# Altium project MB1364.PrjPcb
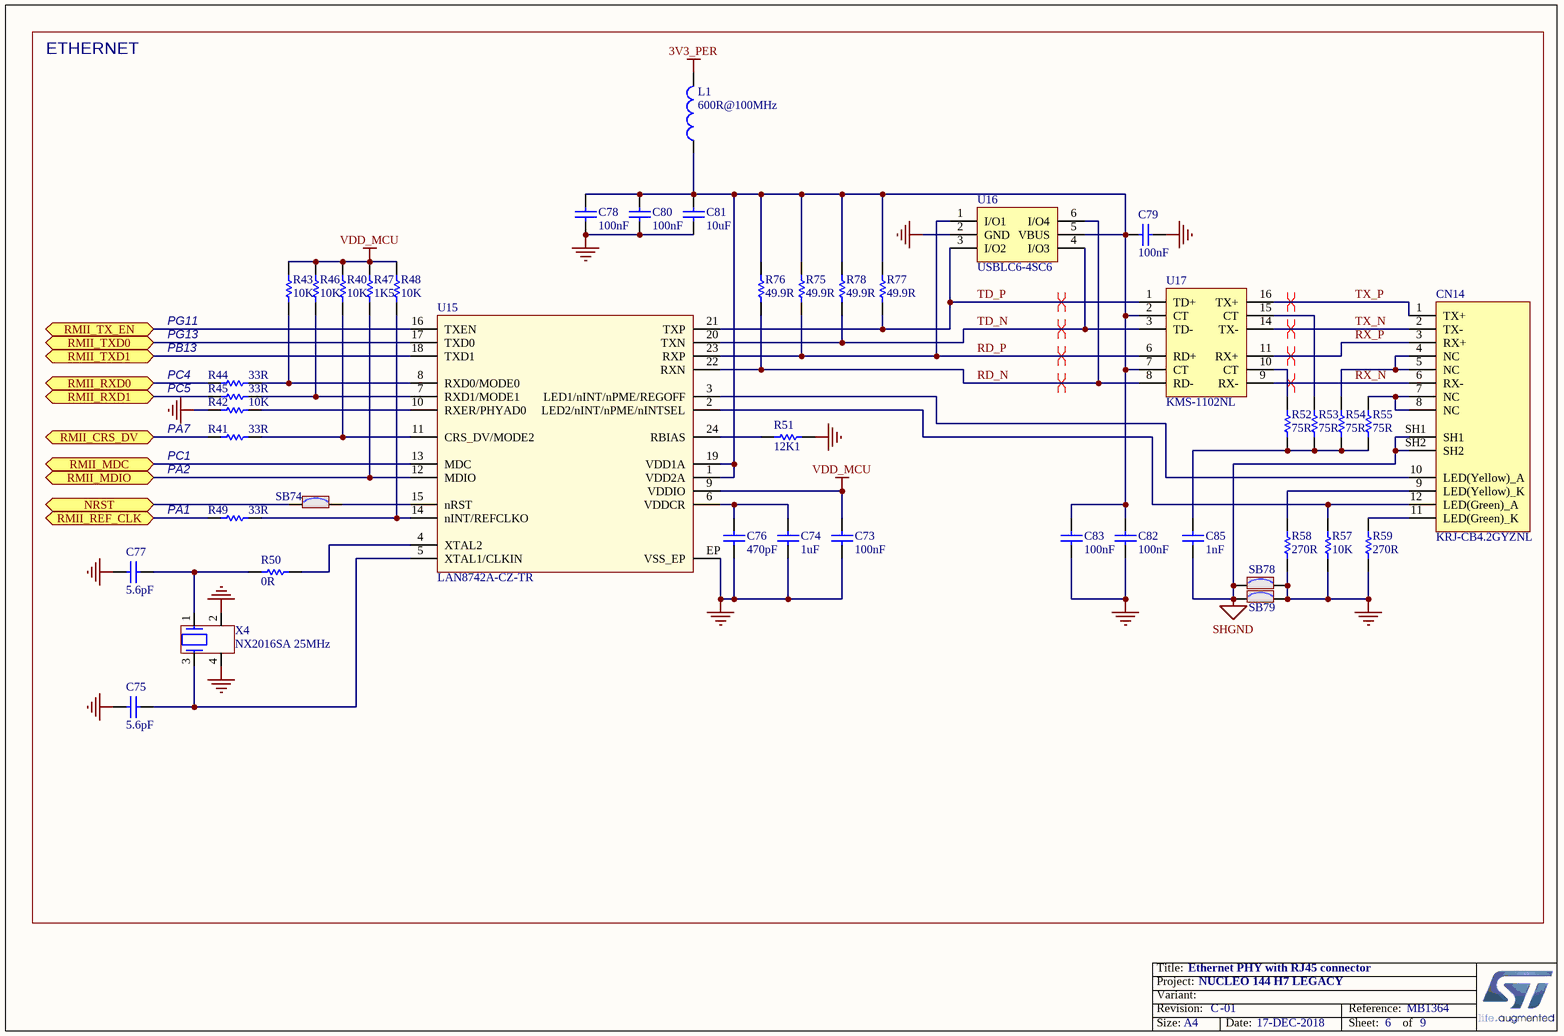
[diagram p0: Ethernet.SchDoc]
Board_Assembly_Revision: 01; Board_Document_Date: 17-DEC-2018; Board_Name: NUCLEO 144 H7 LEGACY; Board_PCB_Revision: C; Board_Reference: MB1364
2 sheets, 59 parts. Net scope: flat (ports and power ports of the same name join across sheets).
Board file: MB1364.PcbDoc
Sheets:
  Ethernet.SchDoc
  USB.SchDoc

## Sheet Ethernet.SchDoc: Ethernet PHY with RJ45 connector
size A4; Date: Not used; ApprovedBy: Not used; CheckedBy: Not used; Author: Not used; CompanyName: STMicroelectronics; DrawnBy: Not used; Engineer: Not used; Organization: Not used; Address1: Not used; Address2: Not used; Address3: Not used; Address4: Not used; DocumentNumber: 6; Revision: Not used; SheetNumber: 6; SheetTotal: 9; Time: Not used; ImagePath: Not used; Application_BuildNumber: Not used

### Parts
C73  value 100nF  [C0603]  (hidden comment: Capacitor)
C74  value 1uF  [C0402]  (hidden comment: Capacitor)
C75  value 5.6pF  [C0402]  (hidden comment: Capacitor)
C76  value 470pF  [C0402]  (hidden comment: Capacitor)
C77  value 5.6pF  [C0402]  (hidden comment: Capacitor)
C78  value 100nF  [C0603]  (hidden comment: Capacitor)
C79  value 100nF  [C0603]  (hidden comment: Capacitor)
C80  value 100nF  [C0603]  (hidden comment: Capacitor)
C81  value 10uF  [C0603]  (hidden comment: Capacitor)
C82  value 100nF  [C0603]  (hidden comment: Capacitor)
C83  value 100nF  [C0603]  (hidden comment: Capacitor)
C85  value 1nF  [C1206_H1P6]  (hidden comment: Capacitor)
CN14  value KRJ-CB4.2GYZNL  [CON_RJ45_DGKYD_KRJ-CB4.2GYZNL]  (hidden comment: RJ45_KRJ-CB4.2GYZNL)
L1  value 600R@100MHz  [L0603]  (hidden comment: BEAD)
R40  value 10K  [R0402]  (hidden comment: Resistor)
R41  value 33R  [R0402]  (hidden comment: Resistor)
R42  value 10K  [R0402]  (hidden comment: Resistor)
R43  value 10K  [R0402]  (hidden comment: Resistor)
R44  value 33R  [R0402]  (hidden comment: Resistor)
R45  value 33R  [R0402]  (hidden comment: Resistor)
R46  value 10K  [R0402]  (hidden comment: Resistor)
R47  value 1K5  [R0402]  (hidden comment: Resistor)
R48  value 10K  [R0402]  (hidden comment: Resistor)
R49  value 33R  [R0402]  (hidden comment: Resistor)
R50  value 0R  [R0402]  (hidden comment: Resistor)
R51  value 12K1  [R0402]  (hidden comment: Resistor)
R52  value 75R  [R0402]  (hidden comment: Resistor)
R53  value 75R  [R0402]  (hidden comment: Resistor)
R54  value 75R  [R0402]  (hidden comment: Resistor)
R55  value 75R  [R0402]  (hidden comment: Resistor)
R57  value 10K  [R0402]  (hidden comment: Resistor)
R58  value 270R  [R0402]  (hidden comment: Resistor)
R59  value 270R  [R0402]  (hidden comment: Resistor)
R75  value 49.9R  [R0402]  (hidden comment: Resistor)
R76  value 49.9R  [R0402]  (hidden comment: Resistor)
R77  value 49.9R  [R0402]  (hidden comment: Resistor)
R78  value 49.9R  [R0402]  (hidden comment: Resistor)
SB74  SB_ON  [SOLDER-BRIDGE_R0603-0R]  (value not drawn)
SB78  SB_ON  [SOLDER-BRIDGE_R0603-0R]  (value not drawn)
SB79  SB_ON  [SOLDER-BRIDGE_R0603-0R]  (value not drawn)
U15  LAN8742A-CZ-TR  [ICC_VQFN24-EPAD_4X4_P050]
U16  USBLC6-4SC6  [ESD_SOT23-6L]
U17  KMS-1102NL  [TRS_DGKYD_KMS-1102NL]
X4  value NX2016SA 25MHz  [CRY_NX2016SA_4P]  (hidden comment: XTAL_4_PINS)

### Ports
NRST (bidir), RMII_CRS_DV (bidir), RMII_MDC (bidir), RMII_MDIO (bidir), RMII_REF_CLK (bidir), RMII_RXD0 (bidir), RMII_RXD1 (bidir), RMII_TX_EN (bidir), RMII_TXD0 (bidir), RMII_TXD1 (bidir)

### Nets
3V3_PER: L1.2
GND: C73.1 C74.1 C75.1 C76.1 C77.1 C78.1 C79.2 C80.1 C81.1 C82.1 C83.1 R42.2 R51.2 R57.1 R58.1 R59.1 SB78.2 SB79.2 U15.EP(VSS_EP) U16.2(GND) X4.2 X4.4
SHGND: C85.1 CN14.SH1 CN14.SH2 SB78.1 SB79.1
VDD_MCU: C73.2 R40.2 R43.2 R46.2 R47.2 R48.2 U15.9(VDDIO)
NRST: SB74.1 ; port NRST
RD_N: R76.1 U15.22(RXN) U16.6(I/O4) U17.8(RD-)
RD_P: R75.1 U15.23(RXP) U16.1(I/O1) U17.6(RD+)
RMII_CRS_DV: R41.1 ; port RMII_CRS_DV
RMII_MDC: U15.13(MDC) ; port RMII_MDC
RMII_MDIO: R47.1 U15.12(MDIO) ; port RMII_MDIO
RMII_REF_CLK: R49.1 ; port RMII_REF_CLK
RMII_RXD0: R44.1 ; port RMII_RXD0
RMII_RXD1: R45.1 ; port RMII_RXD1
RMII_TX_EN: U15.16(TXEN) ; port RMII_TX_EN
RMII_TXD0: U15.17(TXD0) ; port RMII_TXD0
RMII_TXD1: U15.18(TXD1) ; port RMII_TXD1
RX_N: CN14.6(RX-) U17.9(RX-)
RX_P: CN14.3(RX+) U17.11(RX+)
TD_N: R78.1 U15.20(TXN) U16.4(I/O3) U17.3(TD-)
TD_P: R77.1 U15.21(TXP) U16.3(I/O2) U17.1(TD+)
TX_N: CN14.2(TX-) U17.14(TX-)
TX_P: CN14.1(TX+) U17.16(TX+)
NetC74_2: C74.2 C76.2 U15.6(VDDCR)
NetC75_2: C75.2 U15.5(XTAL1/CLKIN) X4.3
NetC77_2: C77.2 R50.1 X4.1
NetC78_2: C78.2 C79.1 C80.2 C81.2 C82.2 C83.2 L1.1 R75.2 R76.2 R77.2 R78.2 U15.1(VDD2A) U15.19(VDD1A) U16.5(VBUS) U17.2(CT) U17.7(CT)
NetC85_2: C85.2 R52.1 R53.1 R54.1 R55.1
NetCN14_4: CN14.4(NC) CN14.5(NC) R54.2
NetCN14_7: CN14.7(NC) CN14.8(NC) R55.2
NetCN14_9: CN14.9(LED(Yellow)_K) R58.2
NetCN14_10: CN14.10(LED(Yellow)_A) U15.3(LED1/nINT/nPME/REGOFF)
NetCN14_11: CN14.11(LED(Green)_K) R59.2
NetCN14_12: CN14.12(LED(Green)_A) R57.2 U15.2(LED2/nINT/nPME/nINTSEL)
NetR40_1: R40.1 R41.2 U15.11(CRS_DV/MODE2)
NetR42_1: R42.1 U15.10(RXER/PHYAD0)
NetR43_1: R43.1 R44.2 U15.8(RXD0/MODE0)
NetR45_2: R45.2 R46.1 U15.7(RXD1/MODE1)
NetR48_1: R48.1 R49.2 U15.14(nINT/REFCLKO)
NetR50_2: R50.2 U15.4(XTAL2)
NetR51_1: R51.1 U15.24(RBIAS)
NetR52_2: R52.2 U17.10(CT)
NetR53_2: R53.2 U17.15(CT)
NetSB74_2: SB74.2 U15.15(nRST)

### Layout directives
differential pair: RD_N, RD_P, RX_N, RX_P, TD_N, TD_P, TX_N, TX_P

### Notes on the sheet
- ETHERNET
- PG11
- PG13
- PB13
- PC4
- PC5
- PA7
- PC1
- PA2
- (near R49) PA1
- Title:
- Project:
- Size:
- Revision:
- Variant:
- A4
- -
- Date:
- Reference:
- Sheet:
- of

### Library data of the parts
C73 C78-C80 C82 C83 = MCD-00237: Capacitor, MLCC, 100nF, 6V3, X5R, 10%, 0603, T=0,8mm; Manufacturer_Part_Number: CC0603KRX5R5BB104; Manufacturer: YAGEO; Provided_By: SUBCO; ECCN_US: EAR99; ECCN_EU: NEC; Internal_Part_Number: MCD-00237; Status: Released; Part_Type: Capacitor; Package: C0603; ComponentLink1Description: Datasheet; ComponentLink1URL: http://tunmcdsvn.tun.st.com/Component_Datasheet_Library/Trunk/Capacitors/Yageo_Multilayer_capacitor_X5R_series_100pF_to_100uF
C74 = MCD-00095: Capacitor, MLCC, 1uF, 6V3, X5R, 10%, 0402, T=0,5mm; Manufacturer_Part_Number: GRM155R61E105KA12; Manufacturer: MURATA; Alternate_Manufacturer_Part_Number: GRM155R60J105KE19; Provided_By: SUBCO; ECCN_US: EAR99; ECCN_EU: NEC; Internal_Part_Number: MCD-00095; Status: Released; Part_Type: Capacitor; Package: C0402; ComponentLink1Description: Datasheet; ComponentLink1URL: http://tunmcdsvn.tun.st.com/Component_Datasheet_Library/Trunk/Capacitors/Murata_Capacitor_GR_series; Alternate_Manufacturer: MURATA
C75 C77 = MCD-01374: Capacitor, MLCC, 5.6pF, 50V, NPO, 5%, 0402, T=0,5mm; Manufacturer_Part_Number: CC0402BRNPO9BN5R6; Manufacturer: YAGEO; Provided_By: SUBCO; Internal_Part_Number: MCD-01374; Status: Released; Part_Type: Capacitor; Package: C0402; ComponentLink1Description: Datasheet; ComponentLink1URL: http://tunmcdsvn.tun.st.com/Component_Datasheet_Library/Trunk/Capacitors/Yageo_Capacitor_NP0_16V-to-50V; ECCN_US: N/A; ECCN_EU: N/A
C76 = MCD-00724: Capacitor, MLCC, 470pF, 50V, NPO, 5%, 0402, T=0,5mm; Manufacturer_Part_Number: CC0402JRNPO9BN471; Manufacturer: YAGEO; Provided_By: SUBCO; Internal_Part_Number: MCD-00724; Status: Released; Part_Type: Capacitor; Package: C0402; ComponentLink1Description: Datasheet; ComponentLink1URL: http://tunmcdsvn.tun.st.com/Component_Datasheet_Library/Trunk/Capacitors/Yageo_Capacitor_NP0_16V-to-50V; ECCN_US: N/A; ECCN_EU: N/A
C81 = MCD-01124: Capacitor, MLCC, 10µF, 10V, X5R, 10%, 0603, T=0.8mm; Manufacturer_Part_Number: GRM188R61A106KAAL; Manufacturer: MURATA; Provided_By: SUBCO; ECCN_US: EAR99; ECCN_EU: NEC; Internal_Part_Number: MCD-01124; Status: Released; Part_Type: Capacitor; Package: C0603; ComponentLink1Description: Datasheet; ComponentLink1URL: http://tunmcdsvn.tun.st.com/Component_Datasheet_Library/Trunk/Capacitors/Murata_Capacitor_GR_series
C85 = MCD-00722: Capacitor, MLCC, 1nF, 2KV, X7R, 10%, 1206, T=1,25mm; Manufacturer_Part_Number: CC1206KKX7RDBB102; Manufacturer: YAGEO; Provided_By: SUBCO; Internal_Part_Number: MCD-00722; Status: Released; Part_Type: Capacitor; Package: C1206; ComponentLink1Description: Datasheet; ComponentLink1URL: http://tunmcdsvn.tun.st.com/Component_Datasheet_Library/Trunk/Capacitors/Yageo_Multilayer_Capacitor_NPO_X7R_1KV_to_3KV_10pF_to_33nF/; ECCN_US: N/A; ECCN_EU: N/A
CN14 = MCD-00717: RJ45 jack, single port, with LEDS, Metal shielded dip low profile; Part_Type: Connector; Manufacturer: DONGGUAN KEYOUDA ELECTRONIC TECHNOLOGY; Provided_By: SUBCO; Internal_Part_Number: MCD-00717; Status: Released; Manufacturer_Part_Number: KRJ-CB4.2GYZNL; ComponentLink1Description: Datasheet; ComponentLink1URL: http://tunmcdsvn.tun.st.com/Component_Datasheet_Library/Trunk/Connectors/DGKYD_RJ45_KRJ-CB4.2GYZNL; ECCN_US: n/a; ECCN_EU: n/a
L1 = MCD-00047: SMD Chip ferrite bead, 600R@100MHz +/-25%, 350mA, 500mohm DC, 0603, T=0.8mm; Part_Type: Inductor; Manufacturer_Part_Number: FCM1608KF-601T03; Manufacturer: TAI-TECH; Provided_By: SUBCO; Internal_Part_Number: MCD-00047; Status: Released; ComponentLink1Description: Datasheet; ComponentLink1URL: http://tunmcdsvn.tun.st.com/Component_Datasheet_Library/Trunk/Inductors/TaiTech_Bead_FCM1608_series; ECCN_US: n/a; ECCN_EU: n/a
R40 R42 R43 R46 R48 R57 = MCD-00053: Resistor,10K,0402,1%,1/16W; Manufacturer_Part_Number: RC0402FR-0710KL; Manufacturer: YAGEO; Provided_By: SUBCO; ECCN_US: EAR99; ECCN_EU: NEC; Internal_Part_Number: MCD-00053; Status: Released; Part_Type: Resistor; Package: R0402; ComponentLink1Description: Datasheet; ComponentLink1URL: http://tunmcdsvn.tun.st.com/Component_Datasheet_Library/Trunk/Resistors/Yageo_Resistor_RC0402-series
R41 R44 R45 R49 = MCD-00455: Resistor,33R,0402,1%,1/16W; Manufacturer_Part_Number: RC0402FR-0733RL; Manufacturer: YAGEO; Provided_By: SUBCO; ECCN_US: EAR99; ECCN_EU: NEC; Internal_Part_Number: MCD-00455; Status: Released; Part_Type: Resistor; Package: R0402; ComponentLink1Description: Datasheet; ComponentLink1URL: http://tunmcdsvn.tun.st.com/Component_Datasheet_Library/Trunk/Resistors/Yageo_Resistor_RC0402-series
R47 = MCD-00068: Resistor,1K5,0402,1%,1/16W; Manufacturer_Part_Number: RC0402FR-071K5L; Manufacturer: YAGEO; Provided_By: SUBCO; ECCN_US: EAR99; ECCN_EU: NEC; Internal_Part_Number: MCD-00068; Status: Released; Part_Type: Resistor; Package: R0402; ComponentLink1Description: Datasheet; ComponentLink1URL: http://tunmcdsvn.tun.st.com/Component_Datasheet_Library/Trunk/Resistors/Yageo_Resistor_RC0402-series
R50 = MCD-00052: Resistor,0R,0402,5%,1/16W; Manufacturer_Part_Number: RC0402JR-070RL; Manufacturer: YAGEO; Provided_By: SUBCO; ECCN_US: EAR99; ECCN_EU: NEC; Internal_Part_Number: MCD-00052; Status: Released; Part_Type: Resistor; Package: R0402; ComponentLink1Description: Datasheet; ComponentLink1URL: http://tunmcdsvn.tun.st.com/Component_Datasheet_Library/Trunk/Resistors/Yageo_Resistor_RC0402-series
R51 = MCD-00723: Resistor,12K1,0402,1%,1/16W; Manufacturer_Part_Number: RC0402FR-0712K1L; Manufacturer: YAGEO; Provided_By: SUBCO; ECCN_US: EAR99; ECCN_EU: NEC; Internal_Part_Number: MCD-00723; Status: Released; Part_Type: Resistor; Package: R0402; ComponentLink1Description: Datasheet; ComponentLink1URL: http://tunmcdsvn.tun.st.com/Component_Datasheet_Library/Trunk/Resistors/Yageo_Resistor_RC0402-series
R52-R55 = MCD-00515: Resistor,75R,0402,1%,1/16W; Manufacturer_Part_Number: RC0402FR-0775RL; Manufacturer: YAGEO; Provided_By: SUBCO; ECCN_US: EAR99; ECCN_EU: NEC; Internal_Part_Number: MCD-00515; Status: Released; Part_Type: Resistor; Package: R0402; ComponentLink1Description: Datasheet; ComponentLink1URL: http://tunmcdsvn.tun.st.com/Component_Datasheet_Library/Trunk/Resistors/Yageo_Resistor_RC0402-series
R58 R59 = MCD-00441: Resistor,270R,0402,1%,1/16W; Manufacturer_Part_Number: RC0402FR-07270RL; Manufacturer: YAGEO; Provided_By: SUBCO; ECCN_US: EAR99; ECCN_EU: NEC; Internal_Part_Number: MCD-00441; Status: Released; Part_Type: Resistor; Package: R0402; ComponentLink1Description: Datasheet; ComponentLink1URL: http://tunmcdsvn.tun.st.com/Component_Datasheet_Library/Trunk/Resistors/Yageo_Resistor_RC0402-series
R75-R78 = MCD-00565: Resistor,49R9,0402,1%,1/16W; Manufacturer_Part_Number: RC0402FR-0749R9L; Manufacturer: YAGEO; Provided_By: SUBCO; ECCN_US: EAR99; ECCN_EU: NEC; Internal_Part_Number: MCD-00565; Status: Released; Part_Type: Resistor; Package: R0402; ComponentLink1Description: Datasheet; ComponentLink1URL: http://tunmcdsvn.tun.st.com/Component_Datasheet_Library/Trunk/Resistors/Yageo_Resistor_RC0402-series
SB74 SB78 SB79 = MCD-00071: Solder Bridge ON; Part_Type: Mechanical; Manufacturer_Part_Number: RC0603JR-070RL; Manufacturer: YAGEO; Provided_By: SUBCO; Internal_Part_Number: MCD-00071; Status: Released; ComponentLink1Description: Datasheet; Package: SB0603; ComponentLink1URL: http://tunmcdsvn.tun.st.com/Component_Datasheet_Library/Trunk/Resistors/Yageo_Resistor_RC0603-series; ECCN_US: n/a; ECCN_EU: n/a
U15 = MCD-00719: 10/100M RMII Ethernet transceiver; Part_Type: IC; Manufacturer: MICROCHIP; Provided_By: SUBCO; Internal_Part_Number: MCD-00719; Value: LAN8742A-CZ-TR; Status: Released; Manufacturer_Part_Number: LAN8742A-CZ-TR; ComponentLink1Description: Datasheet; ComponentLink1URL: http://tunmcdsvn.tun.st.com/Component_Datasheet_Library/Trunk/IC/MICROCHIP_LAN8742A_RMII_PHY; ECCN_US: n/a; ECCN_EU: n/a
U16 = MCD-00250: Very low capacitance ESD protection , 4 lines; Part_Type: IC; Manufacturer: STMICROELECTRONICS; BMS_Part_Number: 9151001; Provided_By: SUBCO with ST control; ECCN_US: EAR99; ECCN_EU: NEC; Internal_Part_Number: MCD-00250; Value: USBLC6-4SC6; Status: Released; Manufacturer_Part_Number: USBLC6-4SC6; ComponentLink1Description: Datasheet; ComponentLink1URL: http://tunmcdsvn.tun.st.com/Component_Datasheet_Library/Trunk/Diodes/STM_ESD_USBLC6-4SC6
U17 = MCD-00718: Discrete Magnetic Transformer Module, 16 pins, SMT, 100 Base-TX; Part_Type: IC; Manufacturer: DONGGUAN KEYOUDA ELECTRONIC TECHNOLOGY; Provided_By: SUBCO; Internal_Part_Number: MCD-00718; Value: KMS-1102NL; Status: Released; Manufacturer_Part_Number: KMS-1102NL; ComponentLink1Description: Datasheet; ComponentLink1URL: http://tunmcdsvn.tun.st.com/Component_Datasheet_Library/Trunk/IC/DGKYD_KMS-1102NL; ECCN_US: n/a; ECCN_EU: n/a
X4 = MCD-01364: Crystal 25MHz, 6pF, +-20ppm, 80ohms max, SMD; Part_Type: Crystal_Osc; Manufacturer_Part_Number: NX2016SA 25MHz EXS00A-CS11321; Manufacturer: NDK; BMS_Part_Number: 9157044; Provided_By: SUBCO; ECCN_US: EAR99; ECCN_EU: NEC; Internal_Part_Number: MCD-01364; Status: Released; Package: NX2016SA; ComponentLink1Description: Datasheet; ComponentLink1URL: http://tunmcdsvn.tun.st.com/Component_Datasheet_Library/Trunk/Crystal_Osc/NDK_NX2016SA 25MHz EXS00A-CS11321 (EXS10B-28187); Order_Code_Digikey: 644-1367

## Sheet USB.SchDoc: USB
size A4; Date: Not used; ApprovedBy: Not used; CheckedBy: Not used; Author: Not used; CompanyName: STMicroelectronics; DrawnBy: Not used; Engineer: Not used; Organization: Not used; Address1: Not used; Address2: Not used; Address3: Not used; Address4: Not used; DocumentNumber: 7; Revision: Not used; SheetNumber: 7; SheetTotal: 9; CurrentTime: Not used; CurrentDate: Not used; Time: Not used; DocumentFullPathAndName: Not used; DocumentName: Not used; ModifiedDate: Not used; ImagePath: Not used; ProjectName: Not used; Application_BuildNumber: Not used
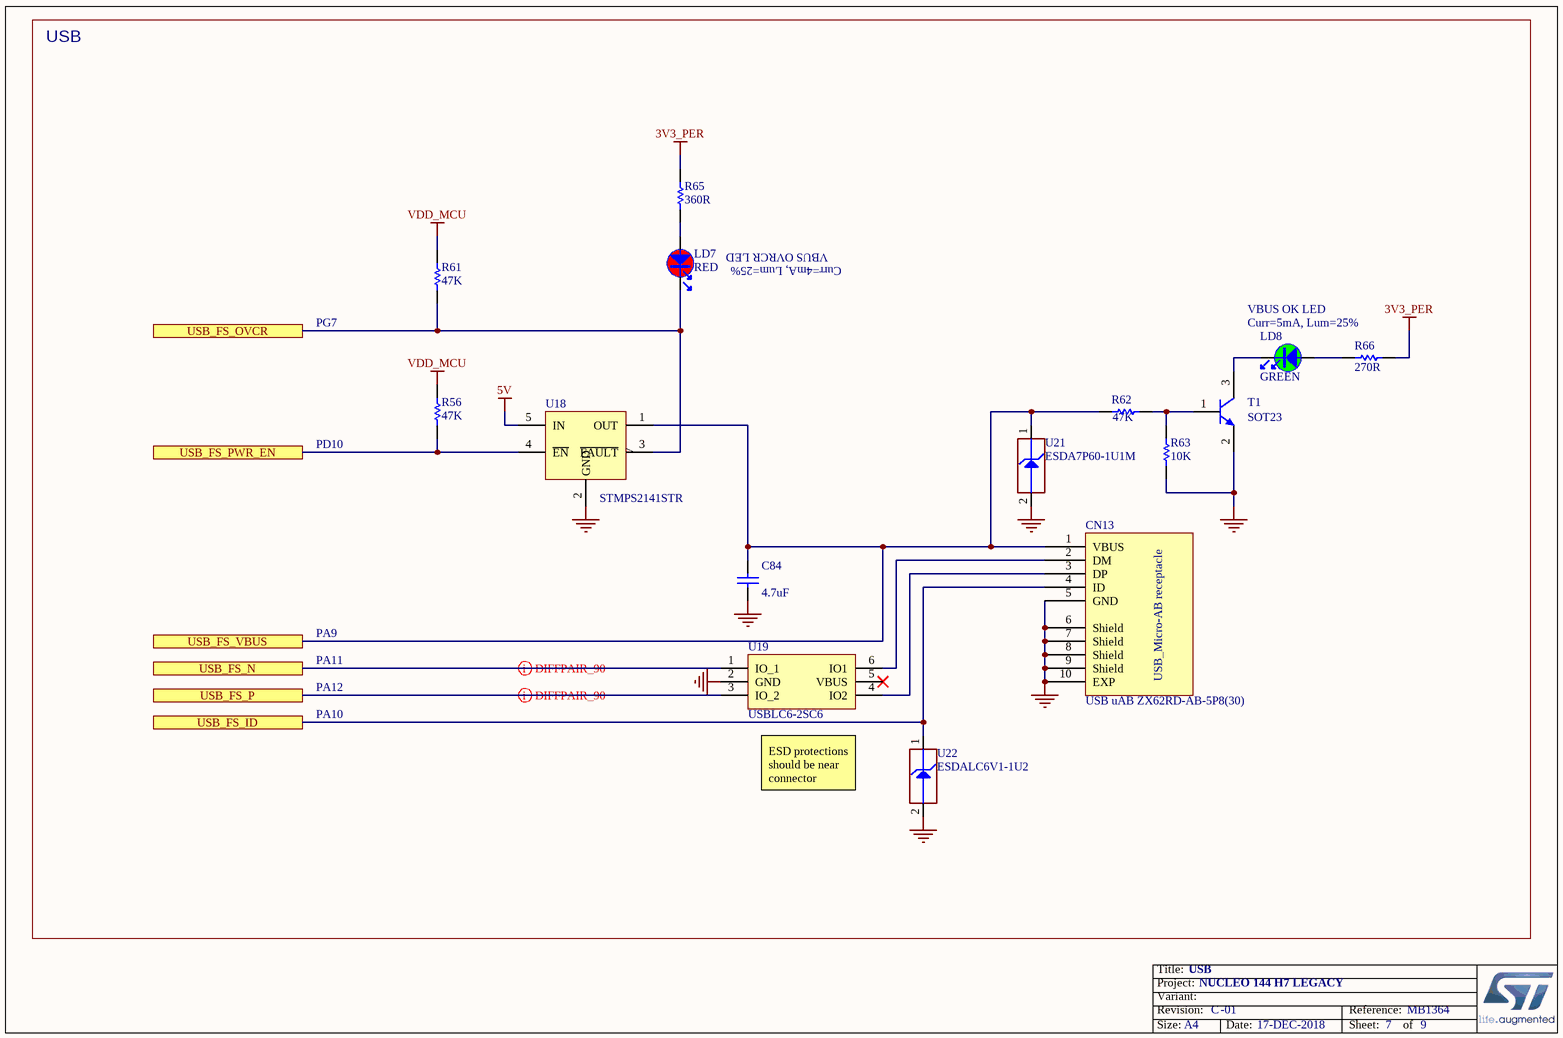
[diagram p1: USB.SchDoc]

### Parts
C84  value 4.7uF  [C0603]  (hidden comment: Capacitor)
CN13  value USB uAB ZX62RD-AB-5P8(30)  [CON_USBMICROAB_MOLEX_47590-0001_H3]  (hidden comment: USB_uAB_47590.0001)
LD7  value RED  [LED_0603_VISHAY_VLMS1300-GS08_RED_1A2K_H0P8]  (hidden comment: LED_red)
LD8  value GREEN  [LED_0603_OSRAM_LG-Q396-PS-35_GREEN_1A2K_H0P4]  (hidden comment: LED_green)
R56  value 47K  [R0402]  (hidden comment: Resistor)
R61  value 47K  [R0402]  (hidden comment: Resistor)
R62  value 47K  [R0402]  (hidden comment: Resistor)
R63  value 10K  [R0402]  (hidden comment: Resistor)
R65  value 360R  [R0402]  (hidden comment: Resistor)
R66  value 270R  [R0402]  (hidden comment: Resistor)
T1  value SOT23  [NPN_SOT23]  (hidden comment: 9013-SOT23)
U18  STMPS2141STR  [MOS_SOT23-5L]
U19  USBLC6-2SC6  [ESD_SOT23-6L]
U21  value ESDA7P60-1U1M  [ESD_QFN2_1P6X1_P125]  (hidden comment: ESD-TRANSIL)
U22  value ESDALC6V1-1U2  [ESD_ST0201]  (hidden comment: ESD-TRANSIL)

### Ports
USB_FS_ID, USB_FS_N, USB_FS_OVCR, USB_FS_P, USB_FS_PWR_EN, USB_FS_VBUS

### Nets
3V3_PER: R65.2 R66.2
5V: U18.5(IN)
GND: C84.1 CN13.5(GND) CN13.6(Shield) CN13.7(Shield) CN13.8(Shield) CN13.9(Shield) CN13.10(EXP) R63.1 T1.2(E) U18.2(GND) U19.2(GND) U21.2(GND) U22.2(GND)
VDD_MCU: R56.1 R61.1
USB_FS_ID: CN13.4(ID) U22.1(IO1) ; port USB_FS_ID
USB_FS_N: U19.1(IO_1) ; port USB_FS_N
USB_FS_OVCR: LD7.2 R61.2 U18.3(~{FAULT}) ; port USB_FS_OVCR
USB_FS_P: U19.3(IO_2) ; port USB_FS_P
USB_FS_PWR_EN: R56.2 U18.4(~{EN}) ; port USB_FS_PWR_EN
USB_FS_VBUS: C84.2 CN13.1(VBUS) R62.1 U18.1(OUT) U21.1(IO1) ; port USB_FS_VBUS
NetCN13_2: CN13.2(DM) U19.6(IO1)
NetCN13_3: CN13.3(DP) U19.4(IO2)
NetLD7_1: LD7.1 R65.1
NetLD8_1: LD8.1 R66.1
NetLD8_2: LD8.2 T1.3(C)
NetR62_2: R62.2 R63.2 T1.1(B)

Not connected (* = marked no-connect by the designer): U19 5(VBUS)*

### Layout directives
differential pair: USB_FS_N, USB_FS_P

### Notes on the sheet
- USB
- VBUS OVRCR LED
- Curr=4mA, Lum=25%
- VBUS OK LED
- PG7
- Curr=5mA, Lum=25%
- PD10
- PA9
- PA11
- PA12
- PA10
- (near U19) ESD protections should be near connector
- Title:
- Project:
- Size:
- Revision:
- Variant:
- A4
- -
- Date:
- Reference:
- Sheet:
- of
- (in symbol MCD-00661) USB_Micro-AB receptacle

### Library data of the parts
C84 = MCD-00009: Capacitor, MLCC, 4.7uF, 16V, X5R, 10%, 0603, T=0.8mm; Manufacturer_Part_Number: CC0603KRX5R7BB475; Manufacturer: YAGEO; Provided_By: SUBCO; ECCN_US: EAR99; ECCN_EU: NEC; Internal_Part_Number: MCD-00009; ComponentLink1Description: Datasheet; Status: Released; Package: C0603; Part_Type: Capacitor; ComponentLink1URL: http://tunmcdsvn.tun.st.com/Component_Datasheet_Library/Trunk/Capacitors/Yageo_Multilayer_capacitor_X5R_series_100pF_to_100uF
CN13 = MCD-00661: USB-MICRO-AB Receptacle, RA, SMT + DIP, Standard, Top Mount, USB certified (symbol & footprint compatible with MCD-00022); Part_Type: Connector; Manufacturer_Part_Number: ZX62RD-AB-5P8(30); Manufacturer: HIROSE; Provided_By: SUBCO; Internal_Part_Number: MCD-00661; Status: Checked; ComponentLink1Description: Datasheet; ComponentLink1URL: http://tunmcdsvn.tun.st.com/Component_Datasheet_Library/Trunk/Connectors/Hirose_ZX_catalog-939768; ECCN_US: n/a; ECCN_EU: n/a
LD7 = MCD-00587: LED Red, 0603 SMD, 2V Forward Voltage; Part_Type: Display; Manufacturer_Part_Number: VLMS1300-GS08; Manufacturer: VISHAY; Alternate_Manufacturer_Part_Number: LS Q976-NR-1; Alternate_Manufacturer: OSRAM OPTO SEMICONDUCTORS; Provided_By: SUBCO; Internal_Part_Number: MCD-00587; Status: Released; Package: LED 0603; ComponentLink1Description: Datasheet; ComponentLink1URL: http://tunmcdsvn.tun.st.com/Component_Datasheet_Library/Trunk/Display/VISHAY_LED_RED_VLMS1300-GS08; Order_Code_Digikey: VLMS1300-GS08CT-ND; Order_Code_Farnell: 2078728; ECCN_US: n/a; ECCN_EU: n/a
LD8 = MCD-00588: LED Green, 0603 SMD, Forward Voltage Typ=2V, Max=2.5V; Part_Type: Display; Manufacturer_Part_Number: LG Q396-PS-35; Manufacturer: OSRAM OPTO SEMICONDUCTORS; Alternate_Manufacturer_Part_Number: VLMTG1300-GS08; Alternate_Manufacturer: VISHAY SEMICONDUCTOR OPTO DIVISION; Provided_By: SUBCO; Internal_Part_Number: MCD-00588; Status: Released; Package: LED 0603; ComponentLink1Description: Datasheet; ComponentLink1URL: http://tunmcdsvn.tun.st.com/Component_Datasheet_Library/Trunk/Display/OSRAM_LED_GREEN_LG Q396-PS-35; Order_Code_Digikey: LG Q396-PS-35-ND; ECCN_US: n/a; ECCN_EU: n/a
R56 R61 R62 = MCD-00063: Resistor,47K,0402,1%,1/16W; Manufacturer_Part_Number: RC0402FR-0747KL; Manufacturer: YAGEO; Provided_By: SUBCO; ECCN_US: EAR99; ECCN_EU: NEC; Internal_Part_Number: MCD-00063; ComponentLink1Description: Datasheet; Status: Released; Part_Type: Resistor; Package: R0402; ComponentLink1URL: http://tunmcdsvn.tun.st.com/Component_Datasheet_Library/Trunk/Resistors/Yageo_Resistor_RC0402-series
R63 = MCD-00053: as R40 on sheet Ethernet; Internal_Part_Number: MCD-00053; Status: Released; ComponentLink1Description: Datasheet; Part_Type: Resistor; Package: R0402; ComponentLink1URL: http://tunmcdsvn.tun.st.com/Component_Datasheet_Library/Trunk/Resistors/Yageo_Resistor_RC0402-series
R65 = MCD-00461: Resistor,360R,0402,1%,1/16W; Manufacturer_Part_Number: RC0402FR-07360RL; Manufacturer: YAGEO; Provided_By: SUBCO; ECCN_US: EAR99; ECCN_EU: NEC; Internal_Part_Number: MCD-00461; Status: Released; Part_Type: Resistor; Package: R0402; ComponentLink1Description: Datasheet; ComponentLink1URL: http://tunmcdsvn.tun.st.com/Component_Datasheet_Library/Trunk/Resistors/Yageo_Resistor_RC0402-series
R66 = MCD-00441: as R58 on sheet Ethernet; Internal_Part_Number: MCD-00441; Status: Released; Part_Type: Resistor; Package: R0402; ComponentLink1Description: Datasheet; ComponentLink1URL: http://tunmcdsvn.tun.st.com/Component_Datasheet_Library/Trunk/Resistors/Yageo_Resistor_RC0402-series
T1 = MCD-00073: NPN Bipolar Transistor; Manufacturer_Part_Number: BSR14; Manufacturer: ON SEMICONDUCTOR; Part_Type: IC; Alternate_Manufacturer_Part_Number: MMBT2222ALT1G / MMBT2222ALT3G; Provided_By: SUBCO; ECCN_US: EAR99; ECCN_EU: NEC; Revision: *; Internal_Part_Number: MCD-00073; ComponentLink1Description: Datasheet; Status: Released; ComponentLink1URL: http://tunmcdsvn.tun.st.com/Component_Datasheet_Library/Trunk/IC/NXP_Transistor_BSR14; Alternate_Manufacturer: ON SEMICONDUCTOR
U18 = MCD-00083: Enhanced single channel power switches with active low enable pin; Part_Type: IC; Manufacturer: STMICROELECTRONICS; Alternate_Manufacturer_Part_Number: TPS2041C; Alternate_Manufacturer: TEXAS INSTRUMENTS; BMS_Part_Number: 9159003; Provided_By: SUBCO with ST control; ECCN_US: EAR99; ECCN_EU: NEC; Internal_Part_Number: MCD-00083; Value: STMPS2141STR; Status: Released; Manufacturer_Part_Number: STMPS2141STR; ComponentLink1Description: Datasheet; ComponentLink1URL: http://tunmcdsvn.tun.st.com/Component_Datasheet_Library/Trunk/IC/STM_PWR-Switch_STMPS2141STR
U19 = MCD-00163: Very low capacitance ESD protection; Part_Type: IC; Manufacturer: STMICROELECTRONICS; BMS_Part_Number: 9151075; Provided_By: SUBCO with ST control; ECCN_US: EAR99; ECCN_EU: NEC; Internal_Part_Number: MCD-00163; Value: USBLC6-2SC6; Status: Released; Manufacturer_Part_Number: USBLC6-2SC6; ComponentLink1Description: Datasheet; ComponentLink1URL: http://tunmcdsvn.tun.st.com/Component_Datasheet_Library/Trunk/Diodes/STM_ESD_USBLC6-2
U21 = MCD-00251: High power transient voltage suppressor, 7V breakdown; Part_Type: Diode; Manufacturer: STMICROELECTRONICS; BMS_Part_Number: 9179042; Provided_By: SUBCO with ST control; ECCN_US: EAR99; ECCN_EU: NEC; Internal_Part_Number: MCD-00251; Status: Released; Manufacturer_Part_Number: ESDA7P60-1U1M; ComponentLink1Description: Datasheet; ComponentLink1URL: http://tunmcdsvn.tun.st.com/Component_Datasheet_Library/Trunk/Diodes/STM_ESD_ESDA7P60-1U1M
U22 = MCD-00170: ESD protection 6V1; Part_Type: Diode; Manufacturer: STMICROELECTRONICS; BMS_Part_Number: 9151132; Provided_By: SUBCO with ST control; ECCN_US: EAR99; ECCN_EU: NEC; Internal_Part_Number: MCD-00170; Status: Released; Manufacturer_Part_Number: ESDALC6V1-1U2; ComponentLink1Description: Datasheet; ComponentLink1URL: http://tunmcdsvn.tun.st.com/Component_Datasheet_Library/Trunk/Diodes/STM_ESD_ESDALC6V1-1U2

## Nets that join several sheets
3V3_PER: Ethernet (L1.2), USB (R65.2 R66.2)
GND: Ethernet (22 pins), USB (13 pins)
VDD_MCU: Ethernet (7 pins), USB (R56.1 R61.1)

## Assembly variants
H743ZI: not fitted C62 C63 C69 C70 C71 C72 CN2 CN11 CN12 R35 R54 R55 R67 SB3 SB4 SB5 SB7 SB9 SB10 SB14 SB15 SB16 SB17 SB18 SB20 SB33 SB34 SB37 SB40 SB41 SB44 SB46 SB47 SB49 SB50 SB55 SB58 SB61 SB62 SB65 SB66 SB69 SB70 SB78 SB79 X3
H7A3ZI: not fitted C62 C63 C69 C70 C71 C72 C73 C74 C75 C76 C77 C78 C79 C80 C81 C82 C83 C85 CN2 CN11 CN12 CN14 HW3 JP6 L1 R35 R40 R41 R42 R43 R44 R45 R46 R47 R48 R49 R50 R51 R52 R53 R54 R55 R57 R58 R59 R67 R75 R76 R77 R78 SB3 SB4 SB5 SB7 SB9 SB10 SB14 SB15 SB16 SB17 SB18 SB20 SB27 SB29 SB30 SB31 SB34 SB35 SB36 SB38 SB40 SB41 SB44 SB46 SB47 SB48 SB54 SB55 SB57 SB58 SB60 SB61 SB62 SB64 SB66 SB69 SB70 SB72 SB74 SB78 SB79 U15 U16 U17 X3 X4
H7B3ZI: not fitted C62 C63 C69 C70 C71 C72 C73 C74 C75 C76 C77 C78 C79 C80 C81 C82 C83 C85 CN2 CN11 CN12 CN14 HW3 JP6 L1 R35 R40 R41 R42 R43 R44 R45 R46 R47 R48 R49 R50 R51 R52 R53 R54 R55 R57 R58 R59 R67 R75 R76 R77 R78 SB3 SB4 SB5 SB7 SB9 SB10 SB14 SB15 SB16 SB17 SB18 SB20 SB27 SB29 SB30 SB31 SB34 SB35 SB36 SB38 SB40 SB41 SB44 SB46 SB47 SB48 SB54 SB55 SB57 SB58 SB60 SB61 SB62 SB64 SB66 SB69 SB70 SB72 SB74 SB78 SB79 U15 U16 U17 X3 X4
H753ZI: not fitted C62 C63 C69 C70 C71 C72 CN2 CN11 CN12 R35 R54 R55 R67 SB3 SB4 SB5 SB7 SB9 SB10 SB14 SB15 SB16 SB17 SB18 SB20 SB33 SB34 SB37 SB40 SB41 SB44 SB46 SB47 SB49 SB50 SB55 SB58 SB61 SB62 SB65 SB66 SB69 SB70 SB78 SB79 X3